# Altium schematic sheet URESP_PULSER_2.SchDoc
size A4
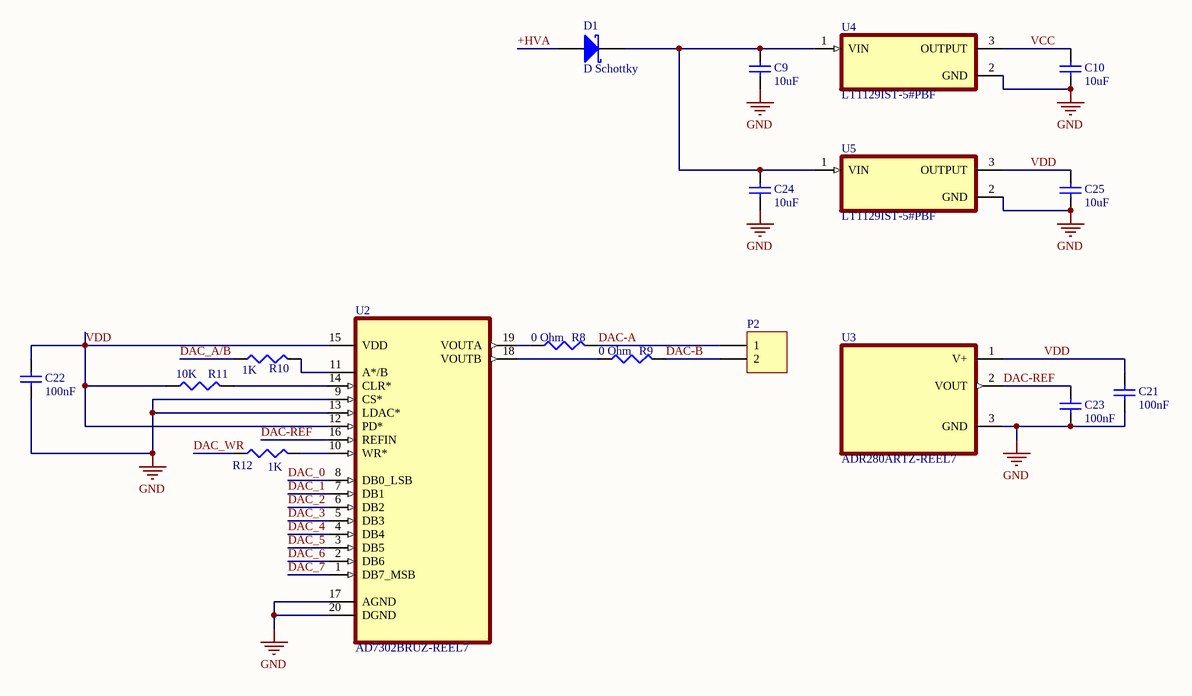
[diagram p0: URESP_PULSER_2.SchDoc]

## Parts
C9  value 10uF  [6-0805_L]
C10  value 10uF  [6-0805_L]
C21  value 100nF  [1608[0603]]
C22  value 100nF  [1608[0603]]
C23  value 100nF  [1608[0603]]
C24  value 10uF  [6-0805_L]
C25  value 10uF  [6-0805_L]
D1  D Schottky  [C1206]
P2  (no value)  [HDR1X2]
R8  value 0 Ohm  [J1-0603]
R9  value 0 Ohm  [J1-0603]
R10  value 1K  [J1-0603]
R11  value 10K  [J1-0603]
R12  value 1K  [J1-0603]
U2  AD7302BRUZ-REEL7  [SOP65P637X110-20N]
U3  ADR280ARTZ-REEL7  [SOT96P237X112-3N]
U4  LT1129IST-5#PBF  [SOT230P700X180-4N]
U5  LT1129IST-5#PBF  [SOT230P700X180-4N]

## Nets
GND: C9.1 C10.1 C21.1 C22.1 C23.1 C24.1 C25.1 U2.9(CS*) U2.13(LDAC*) U2.17(AGND) U2.20(DGND) U3.3(GND) U4.2(GND) U5.2(GND)
+HVA: D1.1(A)
DAC-A: P2.1 R8.2
DAC-B: P2.2 R9.2
DAC-REF: C23.2 U2.16(REFIN) U3.2(VOUT)
DAC_0: U2.8(DB0_LSB)
DAC_1: U2.7(DB1)
DAC_2: U2.6(DB2)
DAC_3: U2.5(DB3)
DAC_4: U2.4(DB4)
DAC_5: U2.3(DB5)
DAC_6: U2.2(DB6)
DAC_7: U2.1(DB7_MSB)
DAC_A/B: R10.1
DAC_WR: R12.1
VCC: C10.2 U4.3(OUTPUT)
VDD: C21.2 C22.2 C25.2 R11.1 U2.12(PD*) U2.15(VDD) U3.1(V+) U5.3(OUTPUT)
NetC9_2: C9.2 C24.2 D1.2(K) U4.1(VIN) U5.1(VIN)
NetR8_1: R8.1 U2.19(VOUTA)
NetR9_1: R9.1 U2.18(VOUTB)
NetR10_2: R10.2 U2.11(A*/B)
NetR11_2: R11.2 U2.14(CLR*)
NetR12_2: R12.2 U2.10(WR*)

## Library data of the parts
C9 C10 C21-C25 = Cap Semi: Capacitor (Semiconductor SIM Model); Published: 8-Jun-2000; LatestRevisionDate: 29-May-2009; LatestRevisionNote: IPC-7351 Footprint Added.; PackageReference: C1206; Publisher: Altium Limited; PackageDescription: Chip Capacitor
D1 = D Schottky: Schottky Diode; Published: 8-Jun-2000; LatestRevisionDate: 17-Jul-2002; LatestRevisionNote: Re-released for DXP Platform.; PackageReference: SMB; Publisher: Altium Limited; PackageDescription: DO-214-AA/SMB; 2 C-Bend Leads; Body 5.3 x 3.6 mm, inc. leads (LxW); Code_JEDEC: DO-214-AA
P2 = Header 2: Header, 2-Pin; LatestRevisionDate: 17-Jul-2002; LatestRevisionNote: Re-released for DXP Platform.; Publisher: Altium Limited
R8-R12 = Res3: Resistor; Published: 8-Jun-2000; LatestRevisionDate: 29-May-2009; LatestRevisionNote: IPC-7351 Footprint Added.; PackageReference: J1-0603; Publisher: Altium Limited; PackageDescription: Chip Resistor
U2 = AD7302BRUZ-REEL7: 8-Bit Digital-to-Analog Converters; MF: {'manufacturer': u'Analog Devices'}; Availability: Unavailable; MP: AD7302BRUZ-REEL7; Package: None; Price: None; Value: *
U3 = ADR280ARTZ-REEL7: MF: {'manufacturer': u'Analog Devices'}; Availability: Unavailable; MP: ADR280ARTZ-REEL7; Package: None; Price: None; Value: *
U4 U5 = LT1129IST-5#PBF: MF: {'manufacturer': u'Analog Devices'}; Availability: Unavailable; Price: None; Value: *; MP: LT1129IST-5#PBF; Package: None